# EAGLE design stonyman-breakout-adc (EAGLE 6.4)
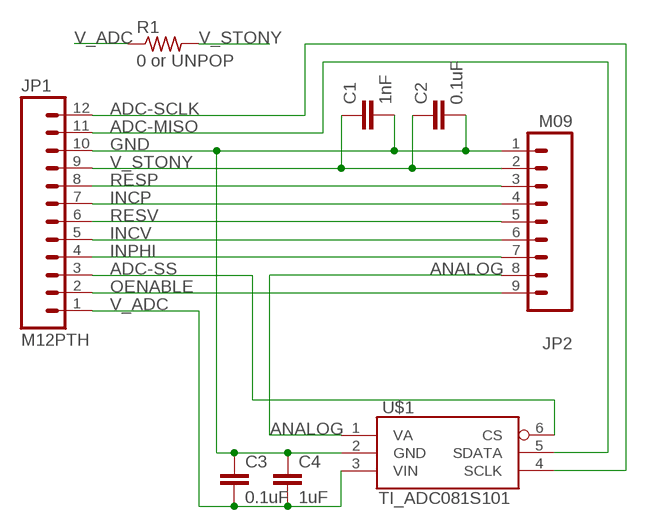
[diagram p0: schematic, sheet 1]

## Parts
C1  1nF  C-EUC0603  [C0603]
C2  0.1uF  C-EUC0603  [C0603]
C3  0.1uF  C-EUC0603  [C0603]
C4  1uF  C-EUC0603  [C0603]
JP1  M12PTH  [1X12]
JP2  M09  [1X09]
R1  0 or UNPOP  R-US_R0603  [R0603]
U$1  TI_ADC081S101  [SOT23-6]

## Nets
ADC-MISO: JP1.11 U$1.5(SDATA)
ADC-SCLK: JP1.12 U$1.4(SCLK)
ADC-SS: JP1.3 U$1.6(CS)
ANALOG: JP2.8 U$1.1(VA)
GND: C1.2 C2.2 C3.1 C4.1 JP1.10 JP2.1 U$1.2(GND)
INCP: JP1.7 JP2.4
INCV: JP1.5 JP2.6
INPHI: JP1.4 JP2.7
OENABLE: JP1.2 JP2.9
RESP: JP1.8 JP2.3
RESV: JP1.6 JP2.5
V_ADC: C3.2 C4.2 JP1.1 R1.1 U$1.3(VIN)
V_STONY: C1.1 C2.1 JP1.9 JP2.2 R1.2

## Library data of the parts
C1-C4 = rcl:C-EU: CAPACITOR, European symbol
JP1 = SparkFun-Connectors:M12: Header 12 Standard 12-pin 0.1" header. Use with straight break away headers (SKU : PRT-00116), right angle break away headers (PRT-00553), swiss pins (PRT-00743), machine pins (PRT-00117), and female headers (PRT-00115).
JP2 = SparkFun-Connectors:M09: Header 9 Standard 9-pin 0.1" header. Use with straight break away headers (SKU : PRT-00116), right angle break away headers (PRT-00553), swiss pins (PRT-00743), machine pins (PRT-00117), and female headers (PRT-00115).
R1 = rcl:R-US_: RESISTOR, American symbol
U$1 = senseye:TI_ADC081S101: Texas Instruments ADC081S101 Single Channel, 0.5 to 1.0 Msps, 8-bit A/D Converter

## Board
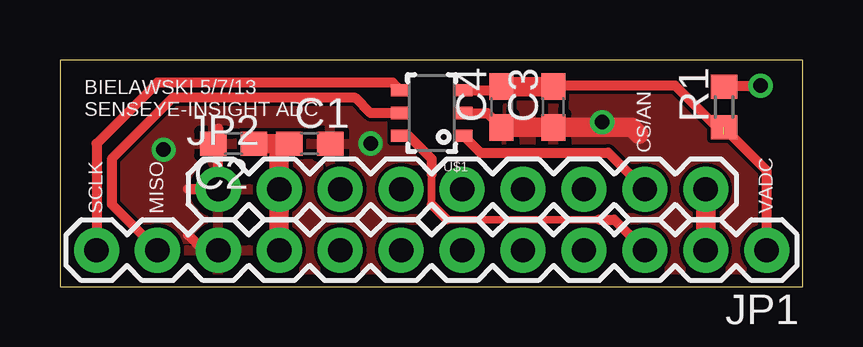
[diagram p1: board, top side]
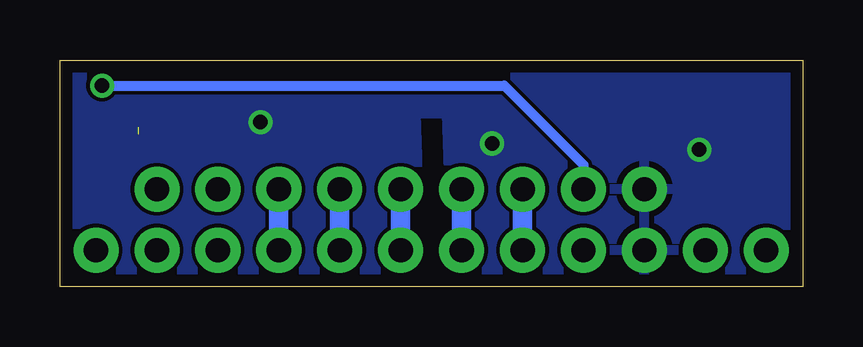
[diagram p2: board, bottom side, seen from below]

Size 30.97 x 9.45 mm. Coordinates in mm from the lower left corner, seen from the top.
Outline: 0,0 30.97,0 30.97,9.45 0,9.45 0,0
Copper layers (1*16): Top 0.0178mm / dielectric 59mil / Bottom 0.0178mm
Design rules "sunstone-2lyr_v1.0.0.3": minimum track width 6mil, minimum drill 14mil, track to track 6mil, track to pad 6mil, pad to pad 6mil, via to via 6mil, smd to smd 6mil, copper to edge 20mil, drill to drill 16mil, minimum pad ring 8mil, minimum via ring 8mil, stop-mask expansion 3mil, vias tented up to drill 0mil, thermal gap 10mil

### Footprints (pad centres in the part's own frame; a part is rotated, then mirrored left to right if it is on the bottom)
C0603 = smd 1.1 x 1: 1 -0.85,0; 2 0.85,0
1X12 = drill 1.016 pad 1.88: 1 0,0; 2 2.54,0; 3 5.08,0; 4 7.62,0; 5 10.16,0; 6 12.7,0; 7 15.24,0; 8 17.78,0; 9 20.32,0; 10 22.86,0; 11 25.4,0; 12 27.94,0
1X09 = drill 1.016 pad 1.88: 1 0,0; 2 2.54,0; 3 5.08,0; 4 7.62,0; 5 10.16,0; 6 12.7,0; 7 15.24,0; 8 17.78,0; 9 20.32,0
R0603 = smd 1 x 1.1: 1 -0.85,0; 2 0.85,0
SOT23-6 = smd 0.8 x 0.51: 1 -1.3,0.95; 2 -1.3,0; 3 -1.3,-0.95; 4 1.3,-0.95; 5 1.3,0; 6 1.3,0.95

### Placement (x,y rotation side)
C1  10.41,5.97 0 top
C2  7.24,5.97 180 top
C3  20.57,7.49 90 top
C4  18.41,7.49 90 top
JP1  29.46,1.52 180 top
JP2  6.6,4.06 0 top
R1  27.69,7.49 90 top
U$1  15.49,7.24 180 top

### Tracks (layer width: path | path; a pad name or v marks a point on that pad's centre or on a via)
ADC-MISO
  Top 0.406: U$1.5 12.95,7.24 12.32,7.87 4.7,7.87 2.16,5.33 2.16,3.43 JP1.11
ADC-SCLK
  Top 0.406: U$1.4 13.87,8.51 4.06,8.51 1.52,5.97 JP1.12
ADC-SS
  Top 0.305: 15.49,4.7 15.49,3.43 | 16.13,2.79 22.48,2.79
  Top 0.406: U$1.6 14.54,6.29 15.49,5.33 15.49,4.7 | 15.49,3.43 16.13,2.79 | 22.48,2.79 23.11,2.79 JP1.3
ANALOG
  Top 0.406: U$1.1 16.82,6.29 17.53,5.59 22.86,5.59 JP2.8
GND  (via drill 0.6)
  Top 0.406: 5.33,4.06 JP2.1 6.6,6.6 | 5.33,2.16 5.97,1.52 JP1.10 | U$1.2 17.82,7.24 C4.1
  Top 0.813: C4.1 23.84,6.64 24.13,6.35
  other vias: 12.95,5.97 4.32,5.71 22.61,6.86
  pour Top: 0,0 14.61,0 14.86,7.87 18.67,7.87 18.41,0 30.99,0 30.99,9.53 0,9.53
  pour Bottom: 0,9.53 30.99,9.53 30.99,0 15.88,0 16.13,7.24 14.86,7.24 14.61,0 0,0
INCP
  Bottom 0.813: JP1.7 JP2.4
INCV
  Bottom 0.813: JP1.5 JP2.6
INPHI
  Bottom 0.813: JP2.7 JP1.4
OENABLE
  Top 0.813: JP2.9 JP1.2
RESP
  Bottom 0.813: JP2.3 JP1.8
RESV
  Bottom 0.813: JP2.5 JP1.6
V_ADC  (1 unrouted)
  Top 0.406: U$1.3 18.26,8.19 C4.2 | JP1.1 29.46,4.83 27.94,6.35 27.69,6.35 25.65,8.38 20.61,8.38 C3.2
  Top 0.813: C4.2 C3.2
V_STONY  (via drill 0.6)
  Top 0.406: R1.2 27.73,8.38 v29.21,8.38
  Top 0.813: JP1.9 JP2.2 9.14,5.97 C1.1 C2.1
  Bottom 0.406: v29.21,8.38 12.45,8.38 9.14,5.08 JP2.2

### Text on the board
tPlace: BIELAWSKI 5/7/13 / SENSEYE-INSIGHT ADC | CS/AN | SCLK | MISO | VADC